# Altium schematic sheet POWER.SchDoc
size A4
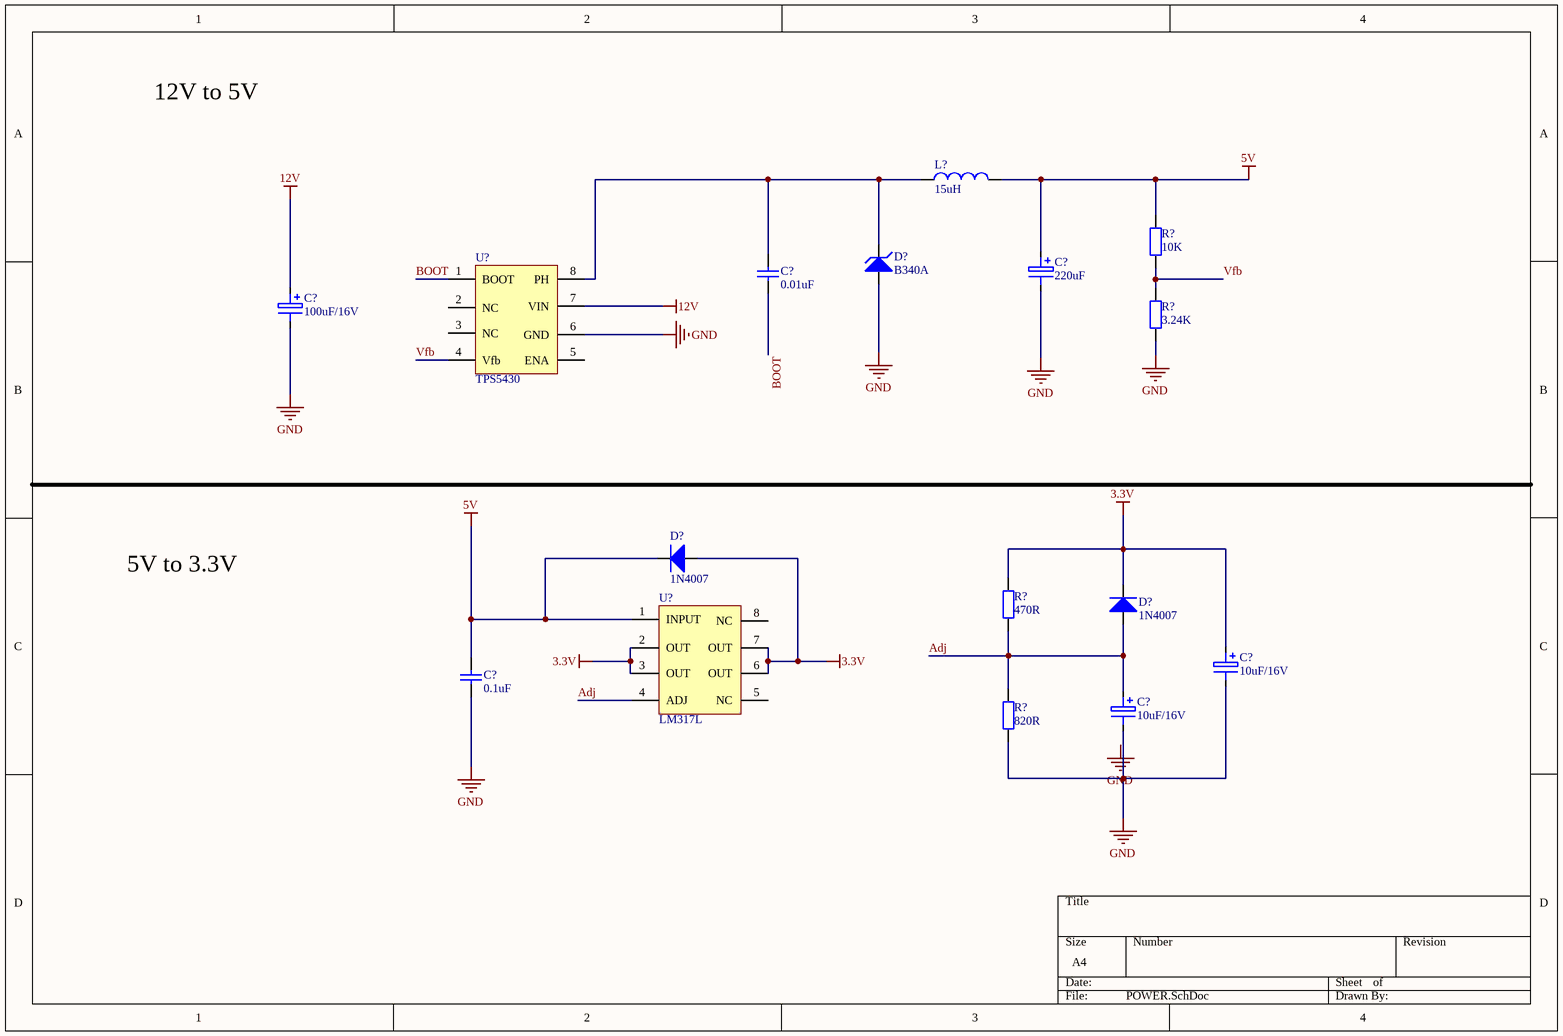
[diagram p0: POWER.SchDoc]

## Parts
(Parts that share a designator on the sheet are numbered #1, #2 ... from top to bottom, then left to right.)
C?#1  220uF  [CAPM-7.0*4.5]
C?#2  0.01uF  [0603]
C?#3  100uF/16V  [CAPM-7.0*4.5]
C?#4  10uF/16V  [CAPM-5.5*3.3]
C?#5  0.1uF  [0603]
C?#6  10uF/16V  [CAPM-5.5*3.3]
D?#1  B340A  [DO214-AC]
D?#2  1N4007  [DO214-AC]
D?#3  1N4007  [DO214-AC]
L?  15uH  [7*7*4-15uH]
R?#1  10K  [0603]
R?#2  3.24K  [0603]
R?#3  470R  [0603]
R?#4  820R  [0603]
U?#1  TPS5430  [TPS5430]
U?#2  LM317L  [LM317L]

## Nets
3.3V: C?#4.1 D?#2.1(A) D?#3.2(K) R?#3.2 U?#2.2(OUT) U?#2.3(OUT) U?#2.6(OUT) U?#2.7(OUT)
5V: C?#1.1 C?#5.2 D?#2.2(K) L?.2 R?#1.2 U?#2.1(INPUT)
12V: C?#3.1 U?#1.7(VIN)
GND: C?#1.2 C?#3.2 C?#4.2 C?#5.1 C?#6.2 D?#1.1(A) R?#2.1 R?#4.1 U?#1.6(GND)
Adj: C?#6.1 D?#3.1(A) R?#3.1 R?#4.2 U?#2.4(ADJ)
BOOT: C?#2.1 U?#1.1(BOOT)
Vfb: R?#1.1 R?#2.2 U?#1.4(Vfb)
NetC?#2_2: C?#2.2 D?#1.2(K) L?.1 U?#1.8(PH)

Not connected (* = marked no-connect by the designer): U?#1 2(NC) 3(NC) 5(ENA); U?#2 5(NC) 8(NC)

## Notes on the sheet
- 12V to 5V
- 5V to 3.3V
- Labels drawn without touching a wire or pin: GND

## Library data of the parts
C?#1 C?#3 C?#4 C?#6 = Cap3: aluminum
C?#2 C?#5 = Cap1: ceramic
D?#1 = B340A-13-F
L? = Inductor
R?#1-R?#4 = Res